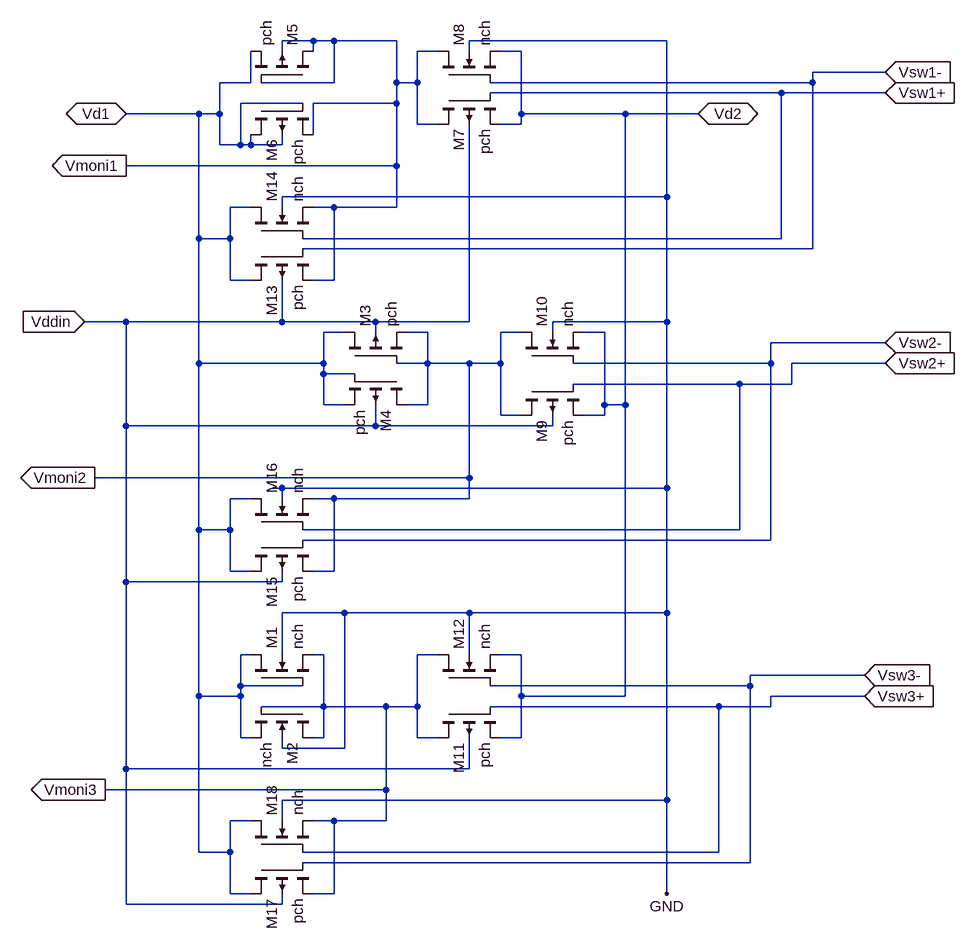
[diagram p0: schematic Distotiondevice1ESD.asc]
Distotiondevice1ESD.asc, the LTspice schematic file:
Version 4
SHEET 1 2252 1512
WIRE 144 -160 96 -160
WIRE 176 -160 144 -160
WIRE 272 -160 176 -160
WIRE 688 -160 384 -160
WIRE 96 -144 96 -160
WIRE 144 -144 144 -160
WIRE 336 -144 304 -144
WIRE 384 -144 384 -160
WIRE 464 -144 432 -144
WIRE 1024 -112 912 -112
WIRE 48 -96 48 -144
WIRE 48 -96 0 -96
WIRE 176 -96 176 -160
WIRE 176 -96 64 -96
WIRE 272 -96 272 -160
WIRE 304 -96 304 -144
WIRE 304 -96 272 -96
WIRE 912 -96 912 -112
WIRE 912 -96 416 -96
WIRE 864 -80 416 -80
WIRE 1024 -80 864 -80
WIRE 128 -64 32 -64
WIRE 272 -64 272 -96
WIRE 272 -64 144 -64
WIRE -32 -48 -144 -48
WIRE 0 -48 0 -96
WIRE 0 -48 -32 -48
WIRE 464 -48 464 -144
WIRE 624 -48 464 -48
WIRE 736 -48 624 -48
WIRE 304 -32 304 -96
WIRE 336 -32 304 -32
WIRE 464 -32 464 -48
WIRE 464 -32 432 -32
WIRE 144 -16 144 -64
WIRE 0 0 0 -48
WIRE 32 0 32 -64
WIRE 32 0 0 0
WIRE 48 0 48 -16
WIRE 48 0 32 0
WIRE 96 0 96 -16
WIRE 96 0 48 0
WIRE 272 32 272 -64
WIRE 272 32 -144 32
WIRE 688 80 688 -160
WIRE 688 80 96 80
WIRE 48 96 16 96
WIRE 96 96 96 80
WIRE 176 96 144 96
WIRE 272 96 272 32
WIRE 272 96 176 96
WIRE -32 144 -32 -48
WIRE 16 144 16 96
WIRE 16 144 -32 144
WIRE 864 144 864 -80
WIRE 864 144 128 144
WIRE 912 160 912 -96
WIRE 912 160 128 160
WIRE 16 208 16 144
WIRE 48 208 16 208
WIRE 176 208 176 96
WIRE 176 208 144 208
WIRE -144 272 -208 272
WIRE 96 272 96 208
WIRE 96 272 -144 272
WIRE 240 272 96 272
WIRE 384 272 384 -32
WIRE 384 272 240 272
WIRE 688 272 688 80
WIRE 688 272 512 272
WIRE 192 288 160 288
WIRE 240 288 240 272
WIRE 320 288 288 288
WIRE 464 288 432 288
WIRE 512 288 512 272
WIRE 592 288 560 288
WIRE 1024 304 848 304
WIRE -32 336 -32 144
WIRE 160 336 160 288
WIRE 160 336 -32 336
WIRE 320 336 320 288
WIRE 320 336 272 336
WIRE 384 336 320 336
WIRE 432 336 432 288
WIRE 432 336 384 336
WIRE 848 336 848 304
WIRE 848 336 544 336
WIRE 1024 336 880 336
WIRE 160 352 160 336
WIRE 208 352 160 352
WIRE 800 368 544 368
WIRE 880 368 880 336
WIRE 880 368 800 368
WIRE 160 400 160 352
WIRE 192 400 160 400
WIRE 320 400 320 336
WIRE 320 400 288 400
WIRE 592 400 592 288
WIRE 624 400 624 -48
WIRE 624 400 592 400
WIRE 432 416 432 336
WIRE 464 416 432 416
WIRE 592 416 592 400
WIRE 592 416 560 416
WIRE -144 432 -144 272
WIRE 240 432 240 400
WIRE 240 432 -144 432
WIRE 512 432 512 416
WIRE 512 432 240 432
WIRE 384 512 384 336
WIRE 384 512 -192 512
WIRE 96 528 80 528
WIRE 688 528 688 272
WIRE 688 528 96 528
WIRE 48 544 16 544
WIRE 96 544 96 528
WIRE 176 544 144 544
WIRE 384 544 384 512
WIRE 384 544 176 544
WIRE -32 592 -32 336
WIRE 16 592 16 544
WIRE 16 592 -32 592
WIRE 800 592 800 368
WIRE 800 592 128 592
WIRE 848 608 848 336
WIRE 848 608 128 608
WIRE 16 656 16 592
WIRE 48 656 16 656
WIRE 176 656 176 544
WIRE 176 656 144 656
WIRE -144 672 -144 432
WIRE 96 672 96 656
WIRE 96 672 -144 672
WIRE 192 720 96 720
WIRE 384 720 192 720
WIRE 688 720 688 528
WIRE 688 720 384 720
WIRE 48 784 32 784
WIRE 96 784 96 720
WIRE 160 784 144 784
WIRE 336 784 304 784
WIRE 384 784 384 720
WIRE 464 784 432 784
WIRE 992 816 816 816
WIRE 32 832 32 784
WIRE 128 832 32 832
WIRE 816 832 816 816
WIRE 816 832 416 832
WIRE -32 848 -32 592
WIRE 32 848 32 832
WIRE 32 848 -32 848
WIRE 464 848 464 784
WIRE 624 848 624 400
WIRE 624 848 464 848
WIRE 992 848 848 848
WIRE 160 864 160 784
WIRE 160 864 64 864
WIRE 256 864 160 864
WIRE 304 864 304 784
WIRE 304 864 256 864
WIRE 768 864 416 864
WIRE 848 864 848 848
WIRE 848 864 768 864
WIRE 32 912 32 848
WIRE 48 912 32 912
WIRE 160 912 160 864
WIRE 160 912 144 912
WIRE 304 912 304 864
WIRE 336 912 304 912
WIRE 464 912 464 848
WIRE 464 912 432 912
WIRE 96 928 96 912
WIRE 192 928 192 720
WIRE 192 928 96 928
WIRE -144 960 -144 672
WIRE 384 960 384 912
WIRE 384 960 -144 960
WIRE 256 992 256 864
WIRE 256 992 -176 992
WIRE 688 1008 688 720
WIRE 688 1008 96 1008
WIRE 48 1040 16 1040
WIRE 96 1040 96 1008
WIRE 176 1040 144 1040
WIRE 256 1040 256 992
WIRE 256 1040 176 1040
WIRE -32 1088 -32 848
WIRE 16 1088 16 1040
WIRE 16 1088 -32 1088
WIRE 768 1088 768 864
WIRE 768 1088 128 1088
WIRE 816 1104 816 832
WIRE 816 1104 128 1104
WIRE 16 1152 16 1088
WIRE 48 1152 16 1152
WIRE 176 1152 176 1040
WIRE 176 1152 144 1152
WIRE 688 1152 688 1008
WIRE -144 1168 -144 960
WIRE 96 1168 96 1152
WIRE 96 1168 -144 1168
FLAG -144 -48 Vd1
IOPIN -144 -48 BiDir
FLAG -208 272 Vddin
IOPIN -208 272 In
FLAG 736 -48 Vd2
IOPIN 736 -48 BiDir
FLAG 688 1152 GND
FLAG 1024 -112 Vsw1-
IOPIN 1024 -112 In
FLAG 1024 -80 Vsw1+
IOPIN 1024 -80 In
FLAG 1024 304 Vsw2-
IOPIN 1024 304 In
FLAG 992 816 Vsw3-
IOPIN 992 816 In
FLAG 1024 336 Vsw2+
IOPIN 1024 336 In
FLAG 992 848 Vsw3+
IOPIN 992 848 In
FLAG -144 32 Vmoni1
IOPIN -144 32 Out
FLAG -192 512 Vmoni2
IOPIN -192 512 Out
FLAG -176 992 Vmoni3
IOPIN -176 992 Out
SYMBOL nmos4 48 832 R270
SYMATTR InstName M1
SYMATTR Value nch
SYMATTR Value2 l=2u w=200u ad=1.4e-9 as=1.4e-9 pd=214e-6 ps=214e-6
SYMBOL nmos4 144 864 R90
SYMATTR InstName M2
SYMATTR Value nch
SYMATTR Value2 l=2u w=200u ad=1.4e-9 as=1.4e-9 pd=214e-6 ps=214e-6
SYMBOL pmos4 192 336 R270
SYMATTR InstName M3
SYMATTR Value pch
SYMATTR Value2 l=2u w=150u ad=1.05e-9 as=1.05e-9 pd=164e-6 ps=164e-6
SYMBOL pmos4 288 352 R90
SYMATTR InstName M4
SYMATTR Value pch
SYMATTR Value2 l=2u w=150u ad=1.05e-9 as=1.05e-9 pd=164e-6 ps=164e-6
SYMBOL pmos4 336 -80 M90
SYMATTR InstName M7
SYMATTR Value pch
SYMATTR Value2 l=2u w=150u ad=1.05e-9 as=1.05e-9 pd=164e-6 ps=164e-6
SYMBOL pmos4 144 -96 M270
SYMATTR InstName M5
SYMATTR Value pch
SYMATTR Value2 l=2u w=100u ad=7e-10 as=3.5e-10 pd=114e-6 ps=64e-6
SYMBOL pmos4 48 -64 M90
SYMATTR InstName M6
SYMATTR Value pch
SYMATTR Value2 l=2u w=100u ad=7e-10 as=3.5e-10 pd=114e-6 ps=64e-6
SYMBOL nmos4 336 -96 R270
SYMATTR InstName M8
SYMATTR Value nch
SYMATTR Value2 l=2u w=150u ad=1.05e-9 as=1.05e-9 pd=164e-6 ps=164e-6
SYMBOL pmos4 464 368 M90
SYMATTR InstName M9
SYMATTR Value pch
SYMATTR Value2 l=2u w=150u ad=1.05e-9 as=1.05e-9 pd=164e-6 ps=164e-6
SYMBOL nmos4 464 336 R270
SYMATTR InstName M10
SYMATTR Value nch
SYMATTR Value2 l=2u w=150u ad=1.05e-9 as=1.05e-9 pd=164e-6 ps=164e-6
SYMBOL pmos4 336 864 M90
SYMATTR InstName M11
SYMATTR Value pch
SYMATTR Value2 l=2u w=150u ad=1.05e-9 as=1.05e-9 pd=164e-6 ps=164e-6
SYMBOL nmos4 336 832 R270
SYMATTR InstName M12
SYMATTR Value nch
SYMATTR Value2 l=2u w=150u ad=1.05e-9 as=1.05e-9 pd=164e-6 ps=164e-6
SYMBOL pmos4 48 160 M90
SYMATTR InstName M13
SYMATTR Value pch
SYMATTR Value2 l=2u w=10u ad=7e-11 as=7e-11 pd=24u ps=24u
SYMBOL nmos4 48 144 R270
SYMATTR InstName M14
SYMATTR Value nch
SYMATTR Value2 l=2u w=6u ad=4.2e-11 as=4.2e-11 pd=20u ps=20u
SYMBOL pmos4 48 608 M90
SYMATTR InstName M15
SYMATTR Value pch
SYMATTR Value2 l=2u w=10u ad=7e-11 as=7e-11 pd=24u ps=24u
SYMBOL nmos4 48 592 R270
SYMATTR InstName M16
SYMATTR Value nch
SYMATTR Value2 l=2u w=6u ad=4.2e-11 as=4.2e-11 pd=20u ps=20u
SYMBOL pmos4 48 1104 M90
SYMATTR InstName M17
SYMATTR Value pch
SYMATTR Value2 l=2u w=10u ad=7e-11 as=7e-11 pd=24u ps=24u
SYMBOL nmos4 48 1088 R270
SYMATTR InstName M18
SYMATTR Value nch
SYMATTR Value2 l=2u w=6u ad=4.2e-11 as=4.2e-11 pd=20u ps=20u

The netlist it stands for:
* Distotiondevice1ESD.asc
M1 Vd1 Vd1 Vmoni3 GND nch l=2u w=200u ad=1.4e-9 as=1.4e-9 pd=214e-6 ps=214e-6
M2 Vmoni3 Vmoni3 Vd1 GND nch l=2u w=200u ad=1.4e-9 as=1.4e-9 pd=214e-6 ps=214e-6
M3 Vd1 Vmoni2 Vmoni2 Vddin pch l=2u w=150u ad=1.05e-9 as=1.05e-9 pd=164e-6 ps=164e-6
M4 Vmoni2 Vd1 Vd1 Vddin pch l=2u w=150u ad=1.05e-9 as=1.05e-9 pd=164e-6 ps=164e-6
M7 Vmoni1 Vsw1+ Vd2 Vddin pch l=2u w=150u ad=1.05e-9 as=1.05e-9 pd=164e-6 ps=164e-6
M5 Vmoni1 Vmoni1 Vd1 Vmoni1 pch l=2u w=100u ad=7e-10 as=3.5e-10 pd=114e-6 ps=64e-6
M6 Vd1 Vd1 Vmoni1 Vd1 pch l=2u w=100u ad=7e-10 as=3.5e-10 pd=114e-6 ps=64e-6
M8 Vmoni1 Vsw1- Vd2 GND nch l=2u w=150u ad=1.05e-9 as=1.05e-9 pd=164e-6 ps=164e-6
M9 Vmoni2 Vsw2+ Vd2 Vddin pch l=2u w=150u ad=1.05e-9 as=1.05e-9 pd=164e-6 ps=164e-6
M10 Vmoni2 Vsw2- Vd2 GND nch l=2u w=150u ad=1.05e-9 as=1.05e-9 pd=164e-6 ps=164e-6
M11 Vmoni3 Vsw3+ Vd2 Vddin pch l=2u w=150u ad=1.05e-9 as=1.05e-9 pd=164e-6 ps=164e-6
M12 Vmoni3 Vsw3- Vd2 GND nch l=2u w=150u ad=1.05e-9 as=1.05e-9 pd=164e-6 ps=164e-6
M13 Vd1 Vsw1- Vmoni1 Vddin pch l=2u w=10u ad=7e-11 as=7e-11 pd=24u ps=24u
M14 Vd1 Vsw1+ Vmoni1 GND nch l=2u w=6u ad=4.2e-11 as=4.2e-11 pd=20u ps=20u
M15 Vd1 Vsw2- Vmoni2 Vddin pch l=2u w=10u ad=7e-11 as=7e-11 pd=24u ps=24u
M16 Vd1 Vsw2+ Vmoni2 GND nch l=2u w=6u ad=4.2e-11 as=4.2e-11 pd=20u ps=20u
M17 Vd1 Vsw3- Vmoni3 Vddin pch l=2u w=10u ad=7e-11 as=7e-11 pd=24u ps=24u
M18 Vd1 Vsw3+ Vmoni3 GND nch l=2u w=6u ad=4.2e-11 as=4.2e-11 pd=20u ps=20u
.model NMOS NMOS
.model PMOS PMOS
.lib standard.mos
.backanno
.end